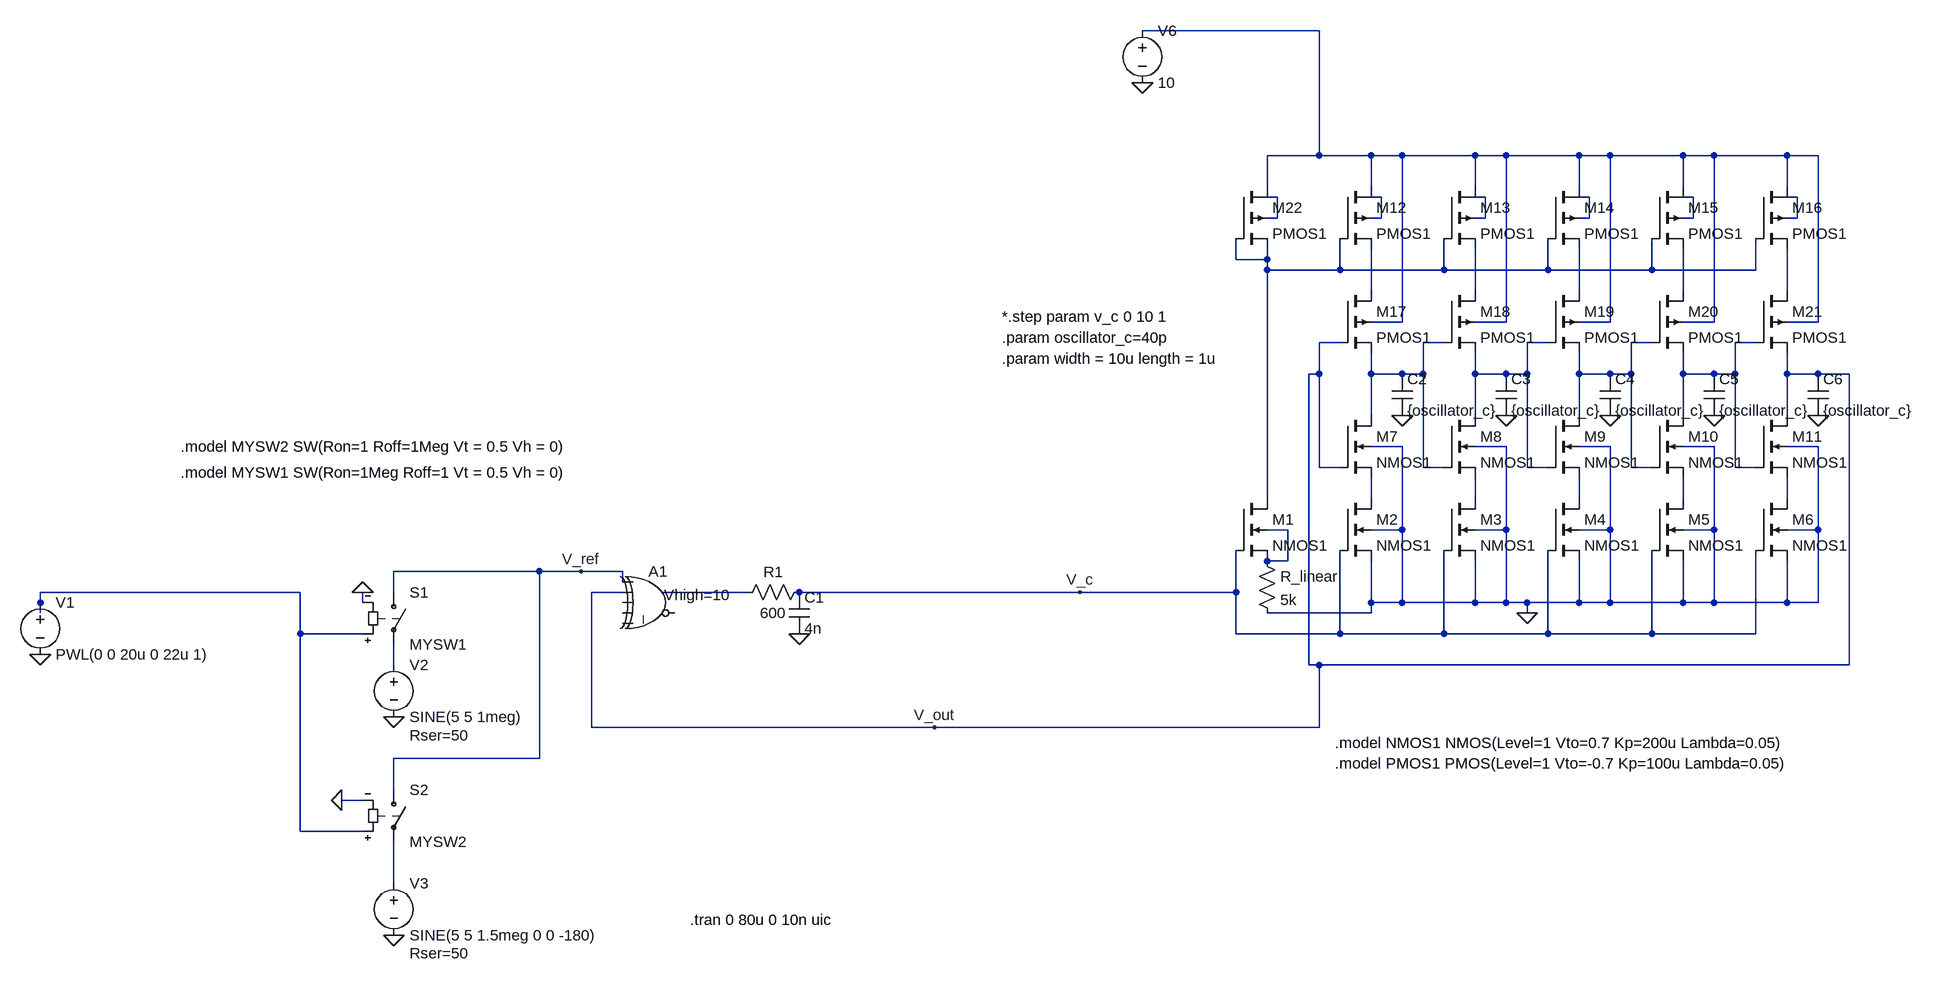
[diagram p0: schematic PLLFinal.asc]
PLLFinal.asc, the LTspice schematic file:
Version 4.1
SHEET 1 6756 736
WIRE 1424 -816 1152 -816
WIRE 1424 -624 1424 -816
WIRE 1424 -624 1344 -624
WIRE 1504 -624 1424 -624
WIRE 1552 -624 1504 -624
WIRE 1664 -624 1552 -624
WIRE 1712 -624 1664 -624
WIRE 1824 -624 1712 -624
WIRE 1872 -624 1824 -624
WIRE 1984 -624 1872 -624
WIRE 2032 -624 1984 -624
WIRE 2144 -624 2032 -624
WIRE 2192 -624 2144 -624
WIRE 1344 -576 1344 -624
WIRE 1504 -576 1504 -624
WIRE 1664 -576 1664 -624
WIRE 1824 -576 1824 -624
WIRE 1984 -576 1984 -624
WIRE 2144 -576 2144 -624
WIRE 1360 -560 1344 -560
WIRE 1520 -560 1504 -560
WIRE 1680 -560 1664 -560
WIRE 1840 -560 1824 -560
WIRE 2000 -560 1984 -560
WIRE 2160 -560 2144 -560
WIRE 1360 -528 1360 -560
WIRE 1360 -528 1344 -528
WIRE 1520 -528 1520 -560
WIRE 1520 -528 1504 -528
WIRE 1680 -528 1680 -560
WIRE 1680 -528 1664 -528
WIRE 1840 -528 1840 -560
WIRE 1840 -528 1824 -528
WIRE 2000 -528 2000 -560
WIRE 2000 -528 1984 -528
WIRE 2160 -528 2160 -560
WIRE 2160 -528 2144 -528
WIRE 1296 -464 1296 -496
WIRE 1344 -464 1344 -480
WIRE 1344 -464 1296 -464
WIRE 1344 -448 1344 -464
WIRE 1456 -448 1456 -496
WIRE 1456 -448 1344 -448
WIRE 1616 -448 1616 -496
WIRE 1616 -448 1456 -448
WIRE 1776 -448 1776 -496
WIRE 1776 -448 1616 -448
WIRE 1936 -448 1936 -496
WIRE 1936 -448 1776 -448
WIRE 2096 -448 2096 -496
WIRE 2096 -448 1936 -448
WIRE 1504 -416 1504 -480
WIRE 1664 -416 1664 -480
WIRE 1824 -416 1824 -480
WIRE 1984 -416 1984 -480
WIRE 2144 -416 2144 -480
WIRE 1552 -368 1552 -624
WIRE 1552 -368 1504 -368
WIRE 1712 -368 1712 -624
WIRE 1712 -368 1664 -368
WIRE 1872 -368 1872 -624
WIRE 1872 -368 1824 -368
WIRE 2032 -368 2032 -624
WIRE 2032 -368 1984 -368
WIRE 2192 -368 2192 -624
WIRE 2192 -368 2144 -368
WIRE 1456 -336 1424 -336
WIRE 1616 -336 1584 -336
WIRE 1776 -336 1744 -336
WIRE 1936 -336 1904 -336
WIRE 2096 -336 2064 -336
WIRE 1424 -288 1424 -336
WIRE 1424 -288 1408 -288
WIRE 1504 -288 1504 -320
WIRE 1552 -288 1504 -288
WIRE 1584 -288 1584 -336
WIRE 1584 -288 1552 -288
WIRE 1664 -288 1664 -320
WIRE 1712 -288 1664 -288
WIRE 1744 -288 1744 -336
WIRE 1744 -288 1712 -288
WIRE 1824 -288 1824 -320
WIRE 1872 -288 1824 -288
WIRE 1904 -288 1904 -336
WIRE 1904 -288 1872 -288
WIRE 1984 -288 1984 -320
WIRE 2032 -288 1984 -288
WIRE 2064 -288 2064 -336
WIRE 2064 -288 2032 -288
WIRE 2144 -288 2144 -320
WIRE 2192 -288 2144 -288
WIRE 2240 -288 2192 -288
WIRE 1504 -224 1504 -288
WIRE 1664 -224 1664 -288
WIRE 1824 -224 1824 -288
WIRE 1984 -224 1984 -288
WIRE 2144 -224 2144 -288
WIRE 1552 -176 1504 -176
WIRE 1712 -176 1664 -176
WIRE 1872 -176 1824 -176
WIRE 2032 -176 1984 -176
WIRE 2192 -176 2144 -176
WIRE 1424 -144 1424 -288
WIRE 1456 -144 1424 -144
WIRE 1584 -144 1584 -288
WIRE 1616 -144 1584 -144
WIRE 1744 -144 1744 -288
WIRE 1776 -144 1744 -144
WIRE 1904 -144 1904 -288
WIRE 1936 -144 1904 -144
WIRE 2064 -144 2064 -288
WIRE 2096 -144 2064 -144
WIRE 1344 -96 1344 -448
WIRE 1504 -96 1504 -128
WIRE 1664 -96 1664 -128
WIRE 1824 -96 1824 -128
WIRE 1984 -96 1984 -128
WIRE 2144 -96 2144 -128
WIRE 1376 -48 1344 -48
WIRE 1552 -48 1552 -176
WIRE 1552 -48 1504 -48
WIRE 1712 -48 1712 -176
WIRE 1712 -48 1664 -48
WIRE 1872 -48 1872 -176
WIRE 1872 -48 1824 -48
WIRE 2032 -48 2032 -176
WIRE 2032 -48 1984 -48
WIRE 2192 -48 2192 -176
WIRE 2192 -48 2144 -48
WIRE 1376 0 1376 -48
WIRE 1376 0 1344 0
WIRE 224 16 0 16
WIRE 288 16 224 16
WIRE 352 16 288 16
WIRE 352 32 352 16
WIRE -144 48 -544 48
WIRE 0 48 0 16
WIRE 352 48 304 48
WIRE 544 48 416 48
WIRE 1056 48 624 48
WIRE 1296 48 1296 -16
WIRE 1296 48 1056 48
WIRE -544 64 -544 48
WIRE -48 64 -48 48
WIRE 1504 64 1504 0
WIRE 1552 64 1552 -48
WIRE 1552 64 1504 64
WIRE 1664 64 1664 0
WIRE 1664 64 1552 64
WIRE 1712 64 1712 -48
WIRE 1712 64 1664 64
WIRE 1744 64 1712 64
WIRE 1824 64 1824 0
WIRE 1824 64 1744 64
WIRE 1872 64 1872 -48
WIRE 1872 64 1824 64
WIRE 1984 64 1984 0
WIRE 1984 64 1872 64
WIRE 2032 64 2032 -48
WIRE 2032 64 1984 64
WIRE 2144 64 2144 0
WIRE 2144 64 2032 64
WIRE 2192 64 2192 -48
WIRE 2192 64 2144 64
WIRE -544 80 -544 64
WIRE 1504 80 1504 64
WIRE 1504 80 1344 80
WIRE 1744 80 1744 64
WIRE -144 112 -144 48
WIRE -48 112 -144 112
WIRE 1296 112 1296 48
WIRE 1456 112 1456 -16
WIRE 1456 112 1296 112
WIRE 1616 112 1616 -16
WIRE 1616 112 1456 112
WIRE 1776 112 1776 -16
WIRE 1776 112 1616 112
WIRE 1936 112 1936 -16
WIRE 1936 112 1776 112
WIRE 2096 112 2096 -16
WIRE 2096 112 1936 112
WIRE 0 160 0 128
WIRE 1408 160 1408 -288
WIRE 1424 160 1408 160
WIRE 2240 160 2240 -288
WIRE 2240 160 1424 160
WIRE 304 256 304 48
WIRE 832 256 304 256
WIRE 1424 256 1424 160
WIRE 1424 256 832 256
WIRE 224 304 224 16
WIRE 224 304 0 304
WIRE 0 352 0 304
WIRE -48 368 -80 368
WIRE -144 416 -144 112
WIRE -48 416 -144 416
WIRE 0 496 0 432
FLAG -48 48 0
FLAG -544 144 0
FLAG 0 240 0
FLAG -80 368 0
FLAG 0 576 0
FLAG 624 112 0
FLAG 1744 80 0
FLAG 1552 -224 0
FLAG 1712 -224 0
FLAG 1872 -224 0
FLAG 2032 -224 0
FLAG 2192 -224 0
FLAG 1152 -736 0
FLAG 1056 48 V_c
FLAG 288 16 V_ref
FLAG 832 256 V_out
SYMBOL Digital\\xor 400 0 R0
WINDOW 3 16 52 Left 2
SYMATTR Value Vhigh=10
SYMATTR InstName A1
SYMBOL voltage -544 48 R0
SYMATTR InstName V1
SYMATTR Value PWL(0 0 20u 0 22u 1)
SYMBOL voltage 0 144 R0
WINDOW 123 0 0 Left 0
WINDOW 39 24 124 Left 2
SYMATTR SpiceLine Rser=50
SYMATTR InstName V2
SYMATTR Value SINE(5 5 1meg)
SYMBOL sw 0 336 R0
SYMATTR InstName S2
SYMATTR Value MYSW2
SYMBOL voltage 0 480 R0
WINDOW 123 0 0 Left 0
WINDOW 39 24 124 Left 2
SYMATTR SpiceLine Rser=50
SYMATTR InstName V3
SYMATTR Value SINE(5 5 1.5meg 0 0 -180)
SYMBOL res 640 32 R90
WINDOW 0 0 56 VBottom 2
WINDOW 3 32 56 VTop 2
SYMATTR InstName R1
SYMATTR Value 600
SYMBOL cap 608 48 R0
SYMATTR InstName C1
SYMATTR Value 4n
SYMBOL sw 0 32 R0
SYMATTR InstName S1
SYMATTR Value MYSW1
SYMBOL nmos4 1296 -96 R0
SYMATTR InstName M1
SYMATTR Value NMOS1
SYMATTR Value2 l={length} w={width}
SYMBOL nmos4 1456 -96 R0
SYMATTR InstName M2
SYMATTR Value NMOS1
SYMATTR Value2 l={length} w={width}
SYMBOL nmos4 1616 -96 R0
SYMATTR InstName M3
SYMATTR Value NMOS1
SYMATTR Value2 l={length} w={width}
SYMBOL nmos4 1776 -96 R0
SYMATTR InstName M4
SYMATTR Value NMOS1
SYMATTR Value2 l={length} w={width}
SYMBOL nmos4 1936 -96 R0
SYMATTR InstName M5
SYMATTR Value NMOS1
SYMATTR Value2 l={length} w={width}
SYMBOL nmos4 2096 -96 R0
SYMATTR InstName M6
SYMATTR Value NMOS1
SYMATTR Value2 l={length} w={width}
SYMBOL nmos4 1456 -224 R0
SYMATTR InstName M7
SYMATTR Value NMOS1
SYMATTR Value2 l={length} w={width}
SYMBOL nmos4 1616 -224 R0
SYMATTR InstName M8
SYMATTR Value NMOS1
SYMATTR Value2 l={length} w={width}
SYMBOL nmos4 1776 -224 R0
SYMATTR InstName M9
SYMATTR Value NMOS1
SYMATTR Value2 l={length} w={width}
SYMBOL nmos4 1936 -224 R0
SYMATTR InstName M10
SYMATTR Value NMOS1
SYMATTR Value2 l={length} w={width}
SYMBOL nmos4 2096 -224 R0
SYMATTR InstName M11
SYMATTR Value NMOS1
SYMATTR Value2 l={length} w={width}
SYMBOL pmos4 1456 -576 R0
SYMATTR InstName M12
SYMATTR Value PMOS1
SYMATTR Value2 l={length} w={width}
SYMBOL pmos4 1616 -576 R0
SYMATTR InstName M13
SYMATTR Value PMOS1
SYMATTR Value2 l={length} w={width}
SYMBOL pmos4 1776 -576 R0
SYMATTR InstName M14
SYMATTR Value PMOS1
SYMATTR Value2 l={length} w={width}
SYMBOL pmos4 1936 -576 R0
SYMATTR InstName M15
SYMATTR Value PMOS1
SYMATTR Value2 l={length} w={width}
SYMBOL pmos4 2096 -576 R0
SYMATTR InstName M16
SYMATTR Value PMOS1
SYMATTR Value2 l={length} w={width}
SYMBOL pmos4 1456 -416 R0
SYMATTR InstName M17
SYMATTR Value PMOS1
SYMATTR Value2 l={length} w={width}
SYMBOL pmos4 1616 -416 R0
SYMATTR InstName M18
SYMATTR Value PMOS1
SYMATTR Value2 l={length} w={width}
SYMBOL pmos4 1776 -416 R0
SYMATTR InstName M19
SYMATTR Value PMOS1
SYMATTR Value2 l={length} w={width}
SYMBOL pmos4 1936 -416 R0
SYMATTR InstName M20
SYMATTR Value PMOS1
SYMATTR Value2 l={length} w={width}
SYMBOL pmos4 2096 -416 R0
SYMATTR InstName M21
SYMATTR Value PMOS1
SYMATTR Value2 l={length} w={width}
SYMBOL pmos4 1296 -576 R0
SYMATTR InstName M22
SYMATTR Value PMOS1
SYMATTR Value2 l={length} w={width}
SYMBOL cap 1536 -288 R0
SYMATTR InstName C2
SYMATTR Value {oscillator_c}
SYMBOL cap 1696 -288 R0
SYMATTR InstName C3
SYMATTR Value {oscillator_c}
SYMBOL cap 1856 -288 R0
SYMATTR InstName C4
SYMATTR Value {oscillator_c}
SYMBOL cap 2016 -288 R0
SYMATTR InstName C5
SYMATTR Value {oscillator_c}
SYMBOL cap 2176 -288 R0
SYMATTR InstName C6
SYMATTR Value {oscillator_c}
SYMBOL voltage 1152 -832 R0
WINDOW 123 0 0 Left 0
WINDOW 39 0 0 Left 0
SYMATTR InstName V6
SYMATTR Value 10
SYMBOL res 1328 -16 R0
SYMATTR InstName R_linear
SYMATTR Value 5k
TEXT -328 -136 Left 2 !.model MYSW1 SW(Ron=1Meg Roff=1 Vt = 0.5 Vh = 0)
TEXT -328 -176 Left 2 !.model MYSW2 SW(Ron=1 Roff=1Meg Vt = 0.5 Vh = 0)
TEXT 1448 280 Left 2 !.model NMOS1 NMOS(Level=1 Vto=0.7 Kp=200u Lambda=0.05)\n.model PMOS1 PMOS(Level=1 Vto=-0.7 Kp=100u Lambda=0.05)
TEXT 456 552 Left 2 !.tran 0 80u 0 10n uic
TEXT 936 -344 Left 2 !.param oscillator_c=40p
TEXT 936 -376 Left 2 !*.step param v_c 0 10 1
TEXT 936 -312 Left 2 !.param width = 10u length = 1u

The netlist it stands for:
* PLLFinal.asc
A1 V_ref V_out 0 0 0 0 N025 0 XOR Vhigh=10
V1 N024 0 PWL(0 0 20u 0 22u 1)
V2 N026 0 SINE(5 5 1meg) Rser=50
S2 V_ref N027 N024 0 MYSW2
V3 N027 0 SINE(5 5 1.5meg 0 0 -180) Rser=50
R1 V_c N025 600
C1 V_c 0 4n
S1 V_ref N026 N024 0 MYSW1
M1 N008 V_c N023 N023 NMOS1 l={length} w={width}
M2 N018 V_c 0 0 NMOS1 l={length} w={width}
M3 N019 V_c 0 0 NMOS1 l={length} w={width}
M4 N020 V_c 0 0 NMOS1 l={length} w={width}
M5 N021 V_c 0 0 NMOS1 l={length} w={width}
M6 N022 V_c 0 0 NMOS1 l={length} w={width}
M7 N014 V_out N018 0 NMOS1 l={length} w={width}
M8 N015 N014 N019 0 NMOS1 l={length} w={width}
M9 N016 N015 N020 0 NMOS1 l={length} w={width}
M10 N017 N016 N021 0 NMOS1 l={length} w={width}
M11 V_out N017 N022 0 NMOS1 l={length} w={width}
M12 N001 N008 N009 N003 PMOS1 l={length} w={width}
M13 N001 N008 N010 N004 PMOS1 l={length} w={width}
M14 N001 N008 N011 N005 PMOS1 l={length} w={width}
M15 N001 N008 N012 N006 PMOS1 l={length} w={width}
M16 N001 N008 N013 N007 PMOS1 l={length} w={width}
M17 N009 V_out N014 N001 PMOS1 l={length} w={width}
M18 N010 N014 N015 N001 PMOS1 l={length} w={width}
M19 N011 N015 N016 N001 PMOS1 l={length} w={width}
M20 N012 N016 N017 N001 PMOS1 l={length} w={width}
M21 N013 N017 V_out N001 PMOS1 l={length} w={width}
M22 N001 N008 N008 N002 PMOS1 l={length} w={width}
C2 N014 0 {oscillator_c}
C3 N015 0 {oscillator_c}
C4 N016 0 {oscillator_c}
C5 N017 0 {oscillator_c}
C6 V_out 0 {oscillator_c}
V6 N001 0 10
R_linear N023 0 5k
.model NMOS NMOS
.model PMOS PMOS
.lib standard.mos
.model MYSW1 SW(Ron=1Meg Roff=1 Vt = 0.5 Vh = 0)
.model MYSW2 SW(Ron=1 Roff=1Meg Vt = 0.5 Vh = 0)
.model NMOS1 NMOS(Level=1 Vto=0.7 Kp=200u Lambda=0.05)
.model PMOS1 PMOS(Level=1 Vto=-0.7 Kp=100u Lambda=0.05)
.tran 0 80u 0 10n uic
.param oscillator_c=40p
*.step param v_c 0 10 1
.param width = 10u length = 1u
.backanno
.end